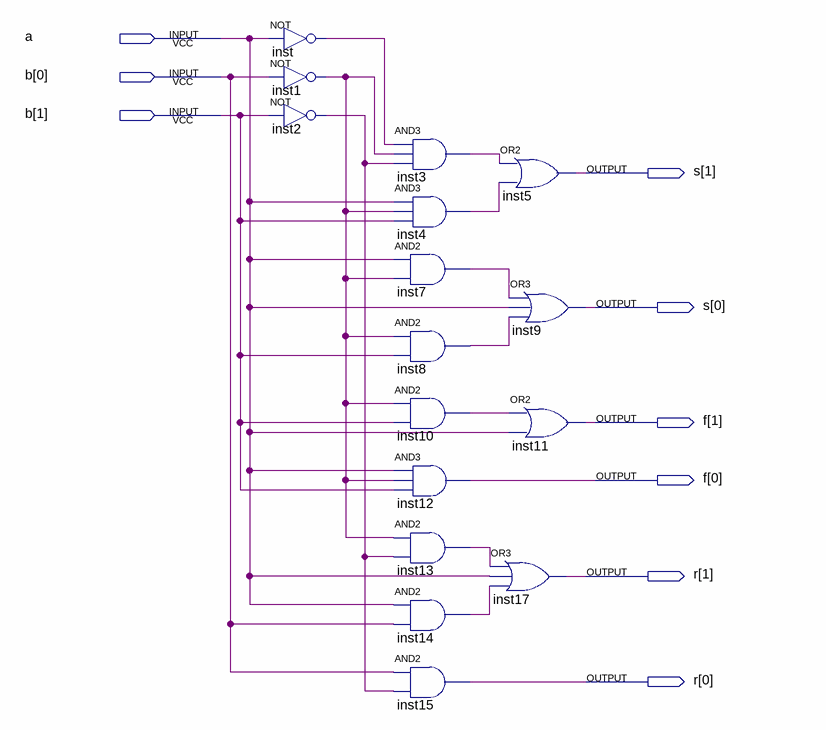
[diagram p0: schematic sheet]
// Quartus schematic lab11 sch.bdf as structural Verilog: 16 symbols, 9 pins
module \lab11_sch  (
  input  a,
  input  [1:0] b,
  output [1:0] s,
  output [1:0] f,
  output [1:0] r
);

  wire inst1_out, inst2_out, inst3_out, inst4_out, inst7_out, inst8_out, inst10_out, inst13_out, inst14_out,
       inst_out;

  not inst (inst_out, a);
  not inst1 (inst1_out, b[0]);
  not inst2 (inst2_out, b[1]);
  and inst3 (inst3_out, inst_out, inst1_out, inst2_out);
  and inst4 (inst4_out, a, inst1_out, b[1]);
  and inst7 (inst7_out, a, inst1_out);
  and inst8 (inst8_out, inst1_out, b[1]);
  and inst10 (inst10_out, inst1_out, b[1]);
  and inst12 (f[0], a, inst1_out, b[1]);
  and inst13 (inst13_out, inst1_out, inst2_out);
  and inst14 (inst14_out, a, b[0]);
  and inst15 (r[0], b[0], inst2_out);
  or inst5 (s[1], inst3_out, inst4_out);
  or inst9 (s[0], inst7_out, a, inst8_out);
  or inst11 (f[1], inst10_out, a);
  or inst17 (r[1], inst13_out, a, inst14_out);
endmodule
